# EAGLE design Dragino-daughterboard (EAGLE 5.10)
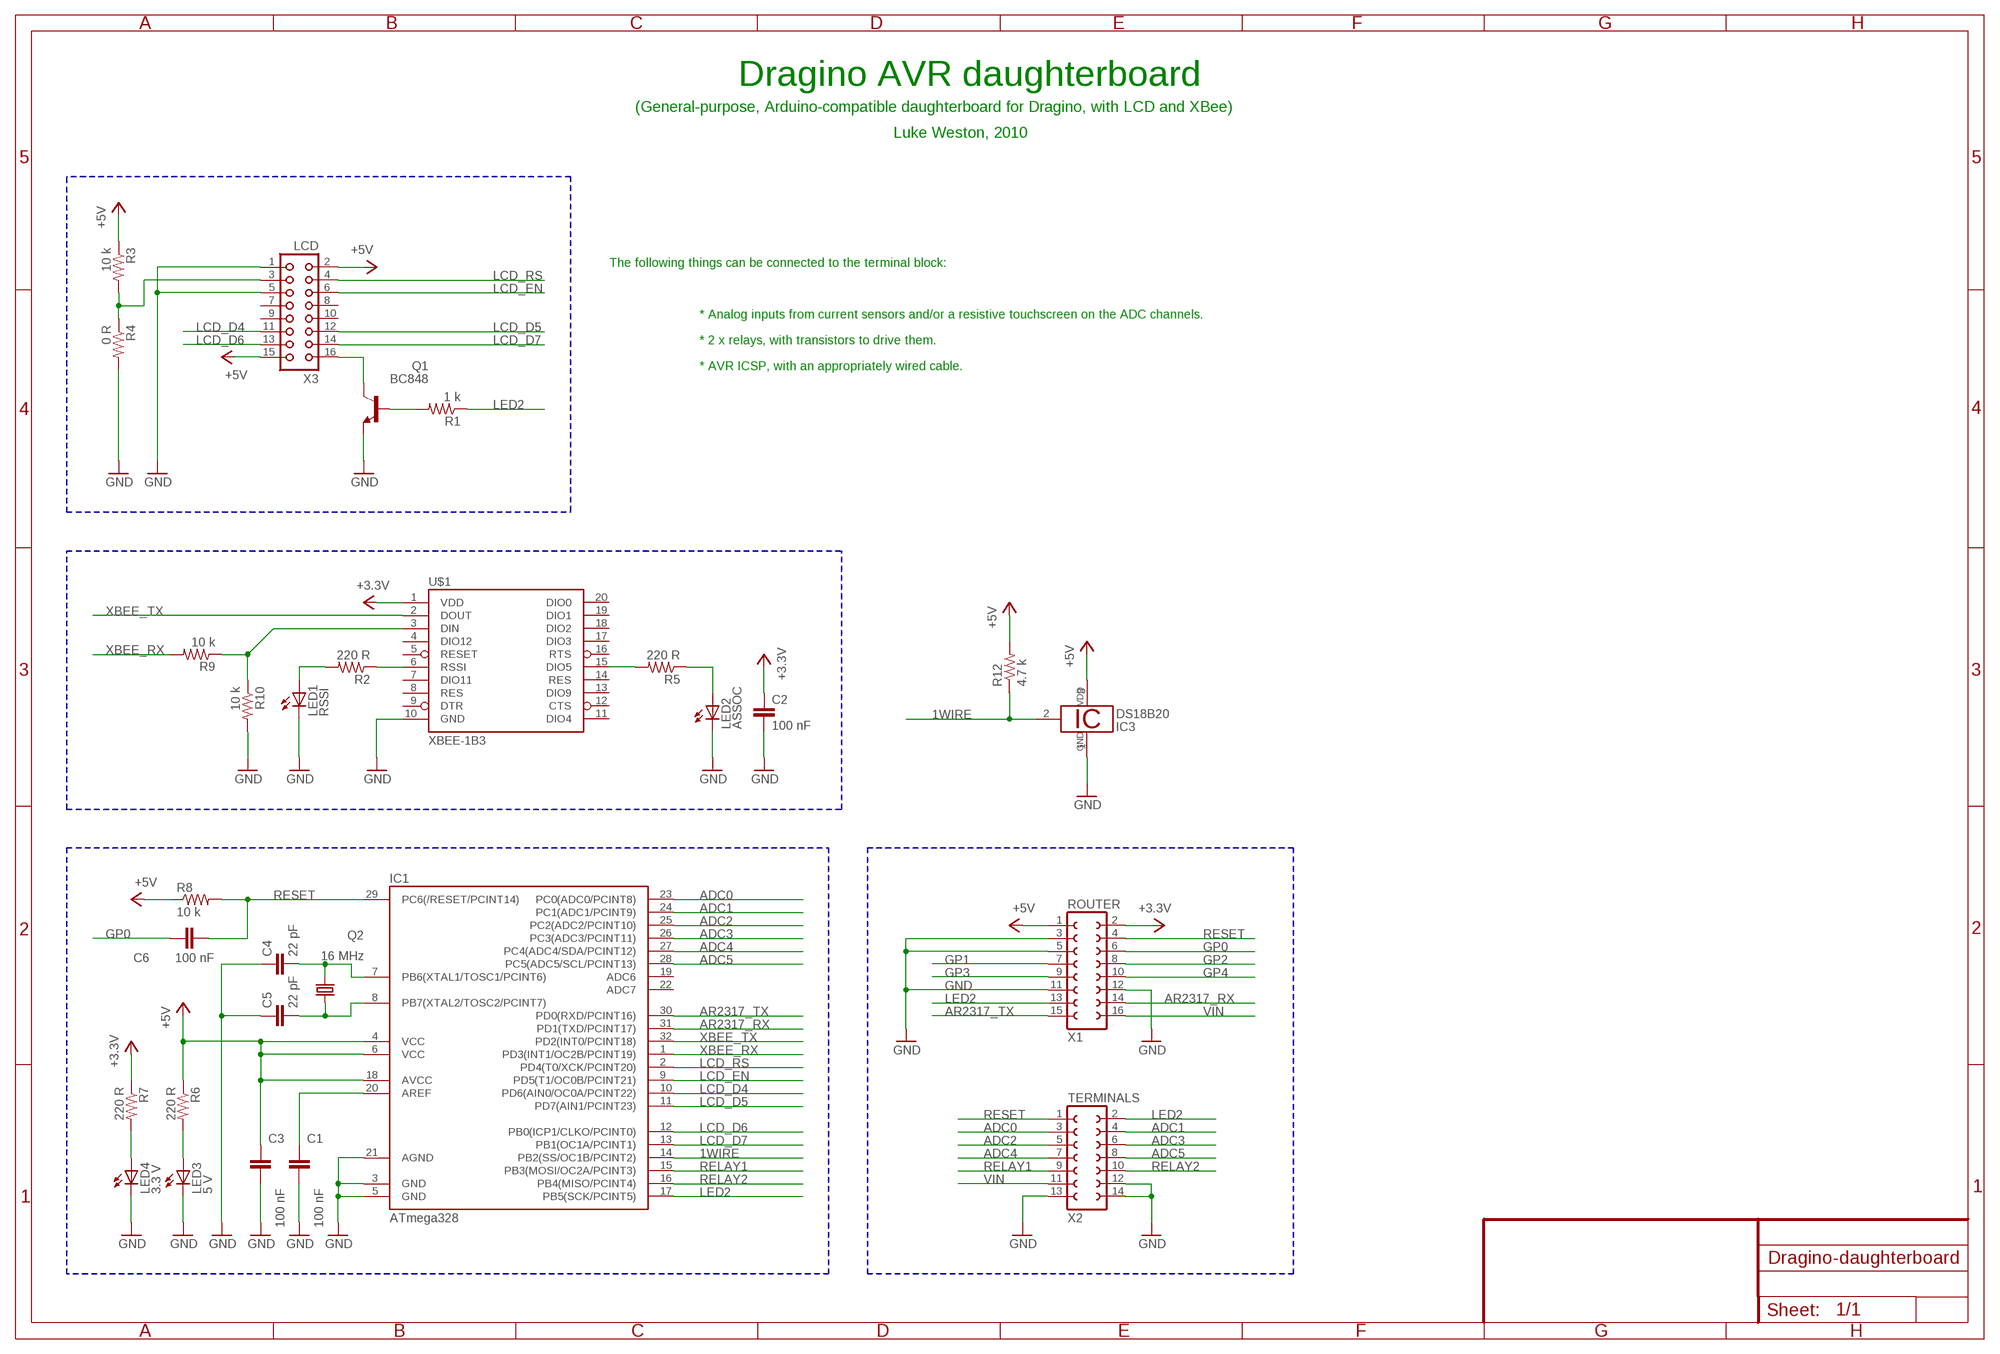
[diagram p0: schematic, sheet 1]

## Parts
C1  100 nF  C-EUC0805K  [C0805K]
C2  100 nF  C-EUC0805K  [C0805K]
C3  100 nF  C-EUC0805K  [C0805K]
C4  22 pF  C-EUC0805K  [C0805K]
C5  22 pF  C-EUC0805K  [C0805K]
C6  100 nF  C-EUC0805K  [C0805K]
IC1  ATmega328  ATMEGA48/88/168-AU  [TQFP32-08]
IC3  DS18B20  DS18S20  [TO92-]
LED1  RSSI  LEDCHIP-LED0805  [CHIP-LED0805]
LED2  ASSOC  LEDCHIP-LED0805  [CHIP-LED0805]
LED3  5 V  LEDCHIP-LED0805  [CHIP-LED0805]
LED4  3.3 V  LEDCHIP-LED0805  [CHIP-LED0805]
Q1  BC848  [SOT23]
Q2  16 MHz  CRYSTALSM49  [SM49]
R1  1 k  R-US_M0805  [M0805]
R2  220 R  R-US_M0805  [M0805]
R3  10 k  R-US_M0805  [M0805]
R4  0 R  R-US_M0805  [M0805]
R5  220 R  R-US_M0805  [M0805]
R6  220 R  R-US_M0805  [M0805]
R7  220 R  R-US_M0805  [M0805]
R8  10 k  R-US_M0805  [M0805]
R9  10 k  R-US_M0805  [M0805]
R10  10 k  R-US_M0805  [M0805]
R12  4.7 k  R-US_M0805  [M0805]
U$1  XBEE-1B3  [XBEE-SMD]
X1  ROUTER  FE08-2  [FE08-2]
X2  TERMINALS  FE07-2  [FE07-2]
X3  LCD  CON16L  [CON16L]

## Nets
1WIRE: IC1.14(PB2(SS/OC1B/PCINT2)) IC3.2 R12.1
+3V3: C2.1 R7.1 U$1.1(VDD) X1.2 ; supply symbol labelled +3.3V
+5V: C3.1 IC1.4(VCC) IC1.6(VCC) IC1.18(AVCC) IC3.3 R3.1 R6.1 R8.1 R12.2 X1.1 X3.2 X3.15
ADC0: IC1.23(PC0(ADC0/PCINT8)) X2.3
ADC1: IC1.24(PC1(ADC1/PCINT9)) X2.4
ADC2: IC1.25(PC2(ADC2/PCINT10)) X2.5
ADC3: IC1.26(PC3(ADC3/PCINT11)) X2.6
ADC4: IC1.27(PC4(ADC4/SDA/PCINT12)) X2.7
ADC5: IC1.28(PC5(ADC5/SCL/PCINT13)) X2.8
AR2317_RX: IC1.31(PD1(TXD/PCINT17)) X1.14
AR2317_TX: IC1.30(PD0(RXD/PCINT16)) X1.15
GND: C1.2 C2.2 C3.2 C4.1 C5.1 IC1.3(GND) IC1.5(GND) IC1.21(AGND) IC3.1 LED1.C LED2.C LED3.C LED4.C Q1.2(E) R4.2 R10.2 U$1.10(GND) X1.3 X1.5 X1.11 X1.12 X2.12 X2.13 X2.14 X3.1 X3.5
GP0: C6.1 X1.6
GP1: X1.7
GP2: X1.8
GP3: X1.9
GP4: X1.10
LCD_D4: IC1.10(PD6(AIN0/OC0A/PCINT22)) X3.11
LCD_D5: IC1.11(PD7(AIN1/PCINT23)) X3.12
LCD_D6: IC1.12(PB0(ICP1/CLKO/PCINT0)) X3.13
LCD_D7: IC1.13(PB1(OC1A/PCINT1)) X3.14
LCD_EN: IC1.9(PD5(T1/OC0B/PCINT21)) X3.6
LCD_RS: IC1.2(PD4(T0/XCK/PCINT20)) X3.4
LED2: IC1.17(PB5(SCK/PCINT5)) R1.1 X1.13 X2.2
N$1: C1.1 IC1.20(AREF)
N$2: R3.2 R4.1 X3.3
N$3: Q1.1(B) R1.2
N$4: LED1.A R2.2
N$5: R2.1 U$1.6(RSSI)
N$6: R5.2 U$1.15(DIO5)
N$7: LED2.A R5.1
N$8: LED3.A R6.2
N$9: LED4.A R7.2
N$10: R9.1 R10.1 U$1.3(DIN)
N$13: C5.2 IC1.8(PB7(XTAL2/TOSC2/PCINT7)) Q2.1
N$14: C4.2 IC1.7(PB6(XTAL1/TOSC1/PCINT6)) Q2.2
N$16: Q1.3(C) X3.16
RELAY1: IC1.15(PB3(MOSI/OC2A/PCINT3)) X2.9
RELAY2: IC1.16(PB4(MISO/PCINT4)) X2.10
RESET: C6.2 IC1.29(PC6(/RESET/PCINT14)) R8.2 X1.4 X2.1
VIN: X1.16 X2.11
XBEE_RX: IC1.1(PD3(INT1/OC2B/PCINT19)) R9.2
XBEE_TX: IC1.32(PD2(INT0/PCINT18)) U$1.2(DOUT)
Unconnected: IC1.19(ADC6) IC1.22(ADC7) U$1.4(DIO12) U$1.5(RESET) U$1.7(DIO11) U$1.8(RES) U$1.9(DTR) U$1.11(DIO4) U$1.12(CTS) U$1.13(DIO9) U$1.14(RES) U$1.16(RTS) U$1.17(DIO3) U$1.18(DIO2) U$1.19(DIO1) U$1.20(DIO0) X3.7 X3.8 X3.9 X3.10

## Buses
B$1
B$2
B$4

## Notes on the sheet
- Dragino AVR daughterboard
- (General-purpose, Arduino-compatible daughterboard for Dragino, with LCD and XBee)
- Luke Weston, 2010
- The following things can be connected to the terminal block:
- * Analog inputs from current sensors and/or a resistive touchscreen on the ADC channels.
- * 2 x relays, with transistors to drive them.
- * AVR ICSP, with an appropriately wired cable.

## Library data of the parts
C1-C6 = rcl:C-EU: CAPACITOR, European symbol
IC1 = atmega8:ATMEGA48/88/168
IC3 = 1wire:DS18S20: High Precision Digital Thermometer This chip provides a onewire thermosensor with approx. 0.5°C accuracy.A programmable over/undertemperure alarm is available. Notes: Vdd must be applied for accurate measurements at low temperatures, as the parasite power circuit otherwise heats the sensor. If parasite power is used, Vdd has to be connected to GND. The DS1822 is a low-cost thermometer chip, the DS18B20 is similar to the DS18S20, but with 9..12 Bit programmable precision. Author: Jan Kandziora <jjj@gmx.de>
LED1-LED4 = led:LED: LED OSRAM: - CHIPLED LG R971, LG N971, LY N971, LG Q971, LY Q971, LO R971, LY R971 LH N974, LH R974 LS Q976, LO Q976, LY Q976 LO Q996 - Hyper CHIPLED LW Q18S LB Q993, LB Q99A, LB R99A - SideLED LS A670, LO A670, LY A670, LG A670, LP A670 LB A673, LV A673, LT A673, LW A673 LH A674 LY A675 LS A676, LA A676, LO A676, LY A676, LW A676 LS A679, LY A679, LG A679 - Hyper Micro SIDELED® LS Y876, LA Y876, LO Y876, LY Y876 LT Y87S - SmartLED LW L88C, LW L88S LB L89C, LB L89S, LG L890 LS L89K, LO L89K, LY L89K LS L896, LA L896, LO L896, LY L896 - TOPLED LS T670, LO T670, LY T670, LG T670, LP T670 LSG T670, LSP T670, LSY T670, LOP T670, LYG T670 LG T671, LOG T671, LSG T671 LB T673, LV T673, LT T673, LW T673 LH T674 LS T676, LA T676, LO T676, LY T676, LB T676, LH T676, LSB T676, LW T676 LB T67C, LV T67C, LT T67C, LS T67K, LO T67K, LY T67K, LW E67C LS E67B, LA E67B, LO E67B, LY E67B, LB E67C, LV E67C, LT E67C LW T67C LS T679, LY T679, LG T679 LS T770, LO T770, LY T770, LG T770, LP T770 LB T773, LV T773, LT T773, LW T773 LH T774 LS E675, LA E675, LY E675, LS T675 LS T776, LA T776, LO T776, LY T776, LB T776 LHGB T686 LT T68C, LB T68C - Hyper Mini TOPLED® LB M676 - Mini TOPLED Santana® LG M470 LS M47K, LO M47K, LY M47K Source: http://www.osram.convergy.de - LUMILED® LXK2-PW12-R00, LXK2-PW12-S00, LXK2-PW14-U00, LXK2-PW14-V00 LXK2-PM12-R00, LXK2-PM12-S00, LXK2-PM14-U00 LXK2-PE12-Q00, LXK2-PE12-R00, LXK2-PE12-S00, LXK2-PE14-T00, LXK2-PE14-U00 LXK2-PB12-K00, LXK2-PB12-L00, LXK2-PB12-M00, LXK2-PB14-N00, LXK2-PB14-P00, LXK2-PB14-Q00 LXK2-PR12-L00, LXK2-PR12-M00, LXK2-PR14-Q00, LXK2-PR14-R00 LXK2-PD12-Q00, LXK2-PD12-R00, LXK2-PD12-S00 LXK2-PH12-R00, LXK2-PH12-S00 LXK2-PL12-P00, LXK2-PL12-Q00, LXK2-PL12-R00 Source: www.luxeon.com
Q1 = transistor:BC848: NPN TRANSISTOR
Q2 = crystal:CRYSTAL: CRYSTAL
R1-R10 R12 = rcl:R-US_: RESISTOR, American symbol
U$1 = SparkFun:XBEE-1
X1 = con-lsta:FE08-2: FEMALE HEADER
X2 = con-lsta:FE07-2: FEMALE HEADER
X3 = con-harting:CON16L: CONNECTOR

## Board
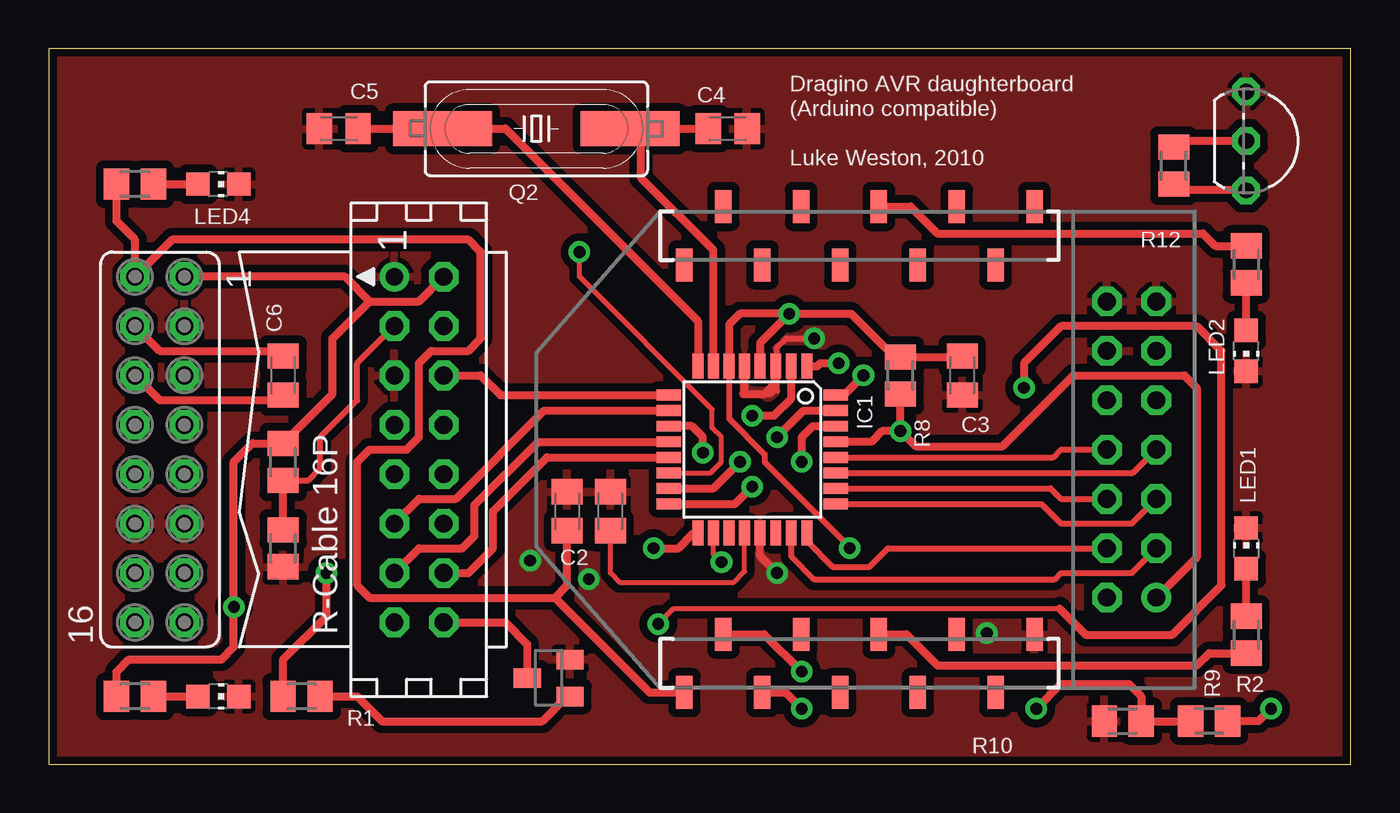
[diagram p1: board, top side]
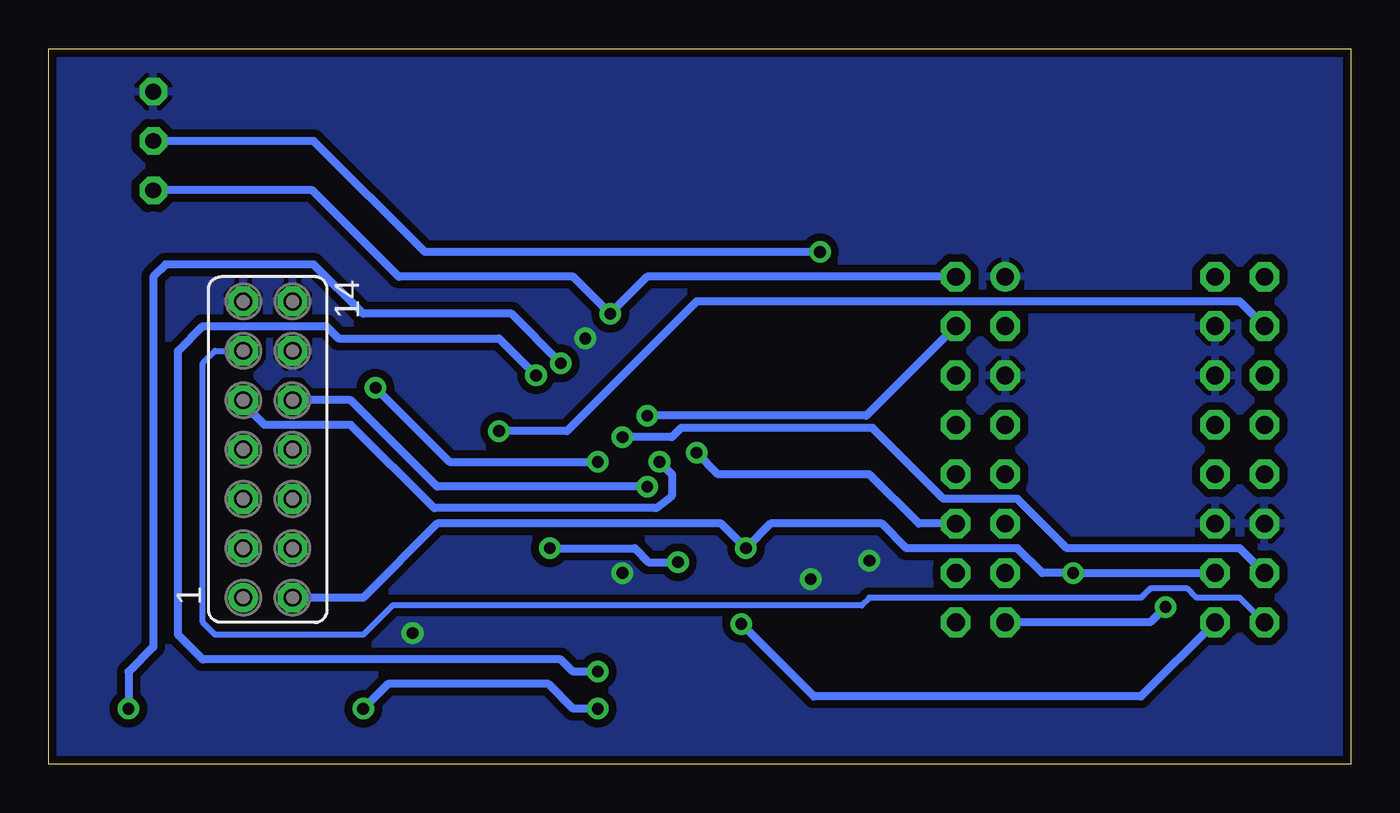
[diagram p2: board, bottom side, seen from below]

Size 66.98 x 36.82 mm. Coordinates in mm from the lower left corner, seen from the top.
Outline: 0,0 66.98,0 66.98,36.82 0,36.82 0,0
Copper layers (1*16): Top 0.035mm / dielectric 1.5mm / Bottom 0.035mm
Design rules "SparkFun": minimum track width 8mil, minimum drill 20mil, track to track 8mil, track to pad 8mil, pad to pad 8mil, via to via 8mil, smd to smd 8mil, copper to edge 10mil, drill to drill 8mil, minimum pad ring 12mil, minimum via ring 10mil, stop-mask expansion 4mil, vias tented up to drill 25mil, thermal gap 10mil

### Footprints (pad centres in the part's own frame; a part is rotated, then mirrored left to right if it is on the bottom)
C0805K = smd 1.3 x 1.6: 1 -1,0; 2 1,0
TQFP32-08 = smd 1.27 x 0.559: 1 -4.293,2.8; 2 -4.293,2; 3 -4.293,1.2; 4 -4.293,0.4; 5 -4.293,-0.4; 6 -4.293,-1.2; 7 -4.293,-2; 8 -4.293,-2.8; 17 4.293,-2.8; 18 4.293,-2; 19 4.293,-1.2; 20 4.293,-0.4; 21 4.293,0.4; 22 4.293,1.2; 23 4.293,2; 24 4.293,2.8 | smd 0.559 x 1.27: 9 -2.8,-4.293; 10 -2,-4.293; 11 -1.2,-4.293; 12 -0.4,-4.293; 13 0.4,-4.293; 14 1.2,-4.293; 15 2,-4.293; 16 2.8,-4.293; 25 2.8,4.293; 26 2,4.293; 27 1.2,4.293; 28 0.4,4.293; 29 -0.4,4.293; 30 -1.2,4.293; 31 -2,4.293; 32 -2.8,4.293
TO92- = drill 0.813 octagon: 1 -2.54,0; 2 0,0; 3 2.54,0
CHIP-LED0805 = smd 1.2 x 1.2: A 0,-1.05; C 0,1.05
SOT23 = smd 1 x 1.4: 1 -0.95,-1.1; 2 0.95,-1.1; 3 0,1.1
SM49 = smd 5.08 x 1.778: 1 -4.826,0; 2 4.826,0
M0805 = smd 1.3 x 1.6: 1 -0.95,0; 2 0.95,0
XBEE-SMD = smd 1.7 x 0.85: 1 -12.5,20; 2 -9.5,18; 3 -12.5,16; 4 -9.5,14; 5 -12.5,12; 6 -9.5,10; 7 -12.5,8; 8 -9.5,6; 9 -12.5,4; 10 -9.5,2; 11 12.5,2; 12 9.5,4; 13 12.5,6; 14 9.5,8; 15 12.5,10; 16 9.5,12; 17 12.5,14; 18 9.5,16; 19 12.5,18; 20 9.5,20
FE08-2 = drill 0.914 octagon: 1 -8.89,1.27; 2 -8.89,-1.27; 3 -6.35,1.27; 4 -6.35,-1.27; 5 -3.81,1.27; 6 -3.81,-1.27; 7 -1.27,1.27; 8 -1.27,-1.27; 9 1.27,1.27; 10 1.27,-1.27; 11 3.81,1.27; 12 3.81,-1.27; 13 6.35,1.27; 14 6.35,-1.27; 15 8.89,1.27; 16 8.89,-1.27
FE07-2 = drill 0.914 round: 1 -7.62,1.27 | drill 0.914 octagon: 2 -7.62,-1.27; 3 -5.08,1.27; 4 -5.08,-1.27; 5 -2.54,1.27; 6 -2.54,-1.27; 7 0,1.27; 8 0,-1.27; 9 2.54,1.27; 10 2.54,-1.27; 11 5.08,1.27; 12 5.08,-1.27; 13 7.62,1.27; 14 7.62,-1.27
CON16L = drill 0.914 round: 1 8.89,1.27 | drill 0.914 octagon: 2 8.89,-1.27; 3 6.35,1.27; 4 6.35,-1.27; 5 3.81,1.27; 6 3.81,-1.27; 7 1.27,1.27; 8 1.27,-1.27; 9 -1.27,1.27; 10 -1.27,-1.27; 11 -3.81,1.27; 12 -3.81,-1.27; 13 -6.35,1.27; 14 -6.35,-1.27; 15 -8.89,1.27; 16 -8.89,-1.27

### Placement (x,y rotation side)
C1  28.89,13.02 90 top
C2  26.67,13.02 90 top
C3  46.99,20 270 top
C4  34.92,32.7 180 top
C5  14.92,32.7 0 top
C6  12.07,20 90 top
IC1  36.2,16.19 270 top
IC3  61.59,32.07 270 top
LED1  61.59,11.11 0 top
LED2  61.59,21.27 180 top
LED3  8.73,3.49 270 top
LED4  8.73,29.84 270 top
Q1  25.72,4.45 90 top
Q2  25.08,32.7 0 top
R1  13.02,3.49 0 top
R2  61.59,6.67 90 top
R3  12.07,15.56 270 top
R4  12.07,11.11 270 top
R5  61.59,25.72 90 top
R6  4.45,3.49 0 top
R7  4.45,29.85 0 top
R8  43.81,20 270 top
R9  59.69,2.22 0 top
R10  55.24,2.22 180 top
R12  57.86,30.8 270 top
U$1  52.7,16.19 90 top
X1  5.71,16.19 270 top
X2  55.7,16.19 90 bottom
X3  19.05,16.19 90 top

### Tracks (layer width: path | path; a pad name or v marks a point on that pad's centre or on a via)
1WIRE  (via drill 0.6)
  Top 0.254: IC1.14 34.04,14.99 34.61,15.56 34.61,16.83 34.13,17.3 34.13,18.26 27.3,25.08 v27.3,26.35
  Top 0.406: IC3.2 58.18,32.07 R12.1
  Bottom 0.406: v27.3,26.35 47.62,26.35 53.34,32.07 IC3.2
+3V3
  Top 0.406: R7.1 3.49,27.94 4.45,26.99 X1.2 6.35,26.99 21.59,26.99 22.23,26.35 22.23,21.91 21.59,21.27 19.68,21.27 19.05,20.64 19.05,16.83 18.41,16.19 16.51,16.19 15.88,15.56 15.88,9.21 16.51,8.57 26.04,8.57 | U$1.1 30.92,3.69 26.04,8.57 | C2.1 26.67,9.21 26.04,8.57
+5V  (via drill 0.6)
  Top 0.254: IC1.18 34.2,10.81 v34.61,10.4
  Top 0.305: IC1.6 34.99,17.78 36.83,15.95 36.83,15.56 41.2,11.19 v41.2,11.11
  Top 0.406: X1.1 15.24,25.08 16.51,23.81 | 16.51,23.81 19.05,23.81 X3.2 | R6.1 3.49,4.77 4.13,5.4 8.89,5.4 9.53,6.03 v9.53,8.1 9.53,15.56 10.47,16.51 R3.1 | R3.1 14.61,19.05 14.61,21.91 16.51,23.81 | R3.1 | C3.1 46.94,20.95 R8.1 43.5,20.95 41.27,23.18 v38.1,23.18 | IC1.4 36.59,21.67 v38.1,23.18 | 34.99,20.57 IC1.6 | 34.99,20.57 34.92,20.64 | 34.99,20.57 34.99,22.61 35.56,23.18 v38.1,23.18 | IC3.3 58.18,29.53 R12.2
  Bottom 0.406: X3.2 36.2,25.08 v38.1,23.18 40,25.08 48.97,25.08 53.42,29.53 IC3.3 | v41.2,11.11 36.83,11.11 36.12,10.4 v34.61,10.4 | X3.15 10.32,7.3 v9.53,8.1
ADC0
  Top 0.305: IC1.23 38.2,10.7 39.37,9.52 51.75,9.52 52.07,9.84 55.7,9.84 X2.3
ADC1
  Top 0.305: IC1.24 38.99,11.49 40.32,10.16 42.23,10.16 43.18,11.11 X2.4
ADC2
  Top 0.305: IC1.25 51.06,13.39 52.07,12.38 55.7,12.38 X2.5
ADC3
  Top 0.305: IC1.26 51.53,14.19 52.07,13.65 X2.6
ADC4
  Top 0.305: IC1.27 55.77,14.99 X2.7
ADC5
  Top 0.305: IC1.28 51.67,15.79 52.07,16.19 X2.8
  Top 0.406: X2.8 53.97,16.19
AR2317_RX  (via drill 0.6)
  Top 0.406: IC1.31 38.83,18.19 v37.46,16.83
  Bottom 0.406: X1.14 5.71,11.11 14.61,11.11 17.14,13.65 20.96,13.65 24.61,17.3 34.45,17.3 34.92,16.83 v37.46,16.83
AR2317_TX  (via drill 0.6)
  Top 0.254: 51.99,8.02 32.15,8.02 v31.35,7.22
  Top 0.406: IC1.30 39.3,17.39 38.73,16.83 v38.73,15.56 | v50.16,19.37 50.16,20.64 52.07,22.54 59.05,22.54 60.32,21.27 60.32,9.21 57.78,6.67 53.34,6.67 51.99,8.02
  Bottom 0.406: X1.15 10.79,3.49 27.62,3.49 v31.35,7.22 | v50.16,19.37 46.35,15.56 v38.73,15.56
GND  (via drill 0.6)
  Top 0.305: 36.83,19.05 37.15,19.05 37.31,19.21 37.31,19.37 | 37.31,19.53 37.31,19.37 | 37.31,19.37 37.46,19.21 37.46,21.43 37.94,21.91 v39.37,21.91
  Top 0.406: IC1.3 37.39,19.61 37.31,19.53 36.83,19.05 35.72,19.05 35.79,19.13 IC1.5 | IC1.21 36.59,10.71 v37.46,9.84
  other vias: 24.77,10.48 48.26,6.75 27.78,9.52
  pour Top (isolate 0.406): -1.91,38.42 68.58,38.42 68.58,-1.59 -1.91,-1.59
  pour Bottom (isolate 0.406): -2.22,38.42 68.58,38.42 68.58,-1.59 -2.22,-1.59
GP0
  Top 0.406: X1.6 5.71,18.73 12.43,18.73 C6.1
LCD_D4
  Top 0.406: X3.11 19.05,13.65 20.96,13.65 25.5,18.19 IC1.10
LCD_D5  (via drill 0.6)
  Top 0.406: IC1.11 33.09,17.39 33.65,16.83 v33.65,16.03
  Bottom 0.406: X3.12 22.23,12.38 24.77,14.92 32.54,14.92 v33.65,16.03
LCD_D6
  Top 0.406: X3.13 19.05,11.11 21.27,11.11 21.91,11.75 21.91,13.33 25.16,16.59 IC1.12
LCD_D7
  Top 0.406: X3.14 21.59,9.84 22.86,11.11 22.86,13.02 25.64,15.79 IC1.13
LCD_EN
  Top 0.406: IC1.9 23.23,18.99 22.23,20 X3.6
LCD_RS  (via drill 0.6)
  Top 0.406: IC1.2 38.2,18.83 37.31,17.94 v36.2,17.94
  Bottom 0.406: v36.2,17.94 24.92,17.94 X3.4
LED2  (via drill 0.6)
  Top 0.406: IC1.17 33.17,11.9 32.38,11.11 v31.11,11.11 | R1.1 12.07,5.4 14.29,7.62 v14.29,9.84
  Bottom 0.406: X1.13 v14.29,9.84 15.88,9.84 17.14,11.11 22.86,11.11 24.13,12.38 29.84,12.38 v31.11,11.11 32.38,12.38 46.99,12.38 50.8,8.57 X2.2
N$1
  Top 0.254: IC1.20 35.79,9.92 35.24,9.37 29.37,9.37 28.89,9.84 C1.1
N$2
  Top 0.305: X3.3 15.88,20.64 15.88,18.73 13.97,16.83 13.97,15.24 13.34,14.61 R3.2
  Top 0.406: R4.1 R3.2
N$3
  Top 0.406: Q1.1 26.67,3.49 25.4,2.22 17.14,2.22 15.88,3.49 R1.2
N$4
  Top 0.406: R2.2 LED1.A
N$5
  Top 0.406: U$1.6 44.11,6.69 45.72,5.08 59.05,5.08 59.69,5.72 R2.1
N$6
  Top 0.406: U$1.15 44.33,28.69 45.72,27.31 59.37,27.31 60.01,26.67 R5.2
N$7
  Top 0.406: LED2.A R5.1
N$8
  Top 0.406: R6.2 LED3.A
N$9
  Top 0.406: R7.2 LED4.A
N$10  (via drill 0.6)
  Top 0.406: U$1.3 37.9,3.69 v38.73,2.86 | v50.8,2.86 52.07,4.13 55.56,4.13 56.2,3.49 R10.1 R9.1
  Bottom 0.406: v38.73,2.86 40,2.86 41.27,4.13 49.53,4.13 v50.8,2.86
N$13
  Top 0.406: C5.2 Q2.1 23.5,32.7 33.39,22.8 IC1.8
N$14
  Top 0.406: 30.48,32.7 Q2.2 | 30.48,32.7 C4.2 | 30.48,32.7 30.48,30.16 34.2,26.45 IC1.7
N$16
  Top 0.406: X3.16 23.5,7.3 24.62,6.18 Q1.3
RELAY1  (via drill 0.6)
  Top 0.406: IC1.15 34.2,14.19 v35.56,15.56
  Bottom 0.406: X2.9 56.97,18.55 55.88,17.46 51.43,17.46 47.15,13.18 35.72,13.18 34.92,13.81 34.92,14.92 v35.56,15.56
RELAY2  (via drill 0.6)
  Top 0.406: IC1.16 35.3,13.39 v36.2,14.29
  Bottom 0.406: v36.2,14.29 46.99,14.29 51.43,18.73 X2.10
RESET  (via drill 0.6)
  Top 0.406: C6.2 12.43,21.27 5.71,21.27 X1.4 | v43.81,17.15 R8.2 | IC1.29 42.31,16.59 42.86,17.15 v43.81,17.15 | X2.1 59.05,10.66 59.05,19.37 58.42,20 52.7,20 49.05,16.35 44.61,16.35 v43.81,17.15 | v43.81,17.15
  Bottom 0.406: X1.4 5.71,23.81 33.65,23.81 40.32,17.15 v43.81,17.15
VIN
  Bottom 0.305: X1.16 5.71,8.57 7.94,8.57 8.41,9.05 10.32,9.05 10.79,8.57 24.77,8.57 25.16,8.18 49.29,8.18 50.8,6.67 58.42,6.67 59.05,7.3 59.05,20.64 58.42,21.27 X2.11
XBEE_RX  (via drill 0.6)
  Top 0.406: IC1.1 39.53,20.49 39.69,20.64 v40.64,20.64 | R9.2 62.23,2.22 v62.87,2.86
  Bottom 0.406: v40.64,20.64 43.18,23.18 50.8,23.18 53.34,25.72 60.96,25.72 61.59,25.08 61.59,6.03 62.87,4.76 v62.87,2.86
XBEE_TX  (via drill 0.6)
  Top 0.406: IC1.32 40.9,18.99 v41.91,20 | U$1.2 36.8,6.69 v38.73,4.76
  Bottom 0.406: v41.91,20 43.81,21.91 52.07,21.91 52.7,22.54 59.05,22.54 60.32,21.27 60.32,6.67 59.05,5.4 40.64,5.4 40,4.76 v38.73,4.76

### Text on the board
tPlace: Dragino AVR daughterboard | (Arduino compatible) | Luke Weston, 2010